# Altium schematic sheet charger.SchDoc
size A3
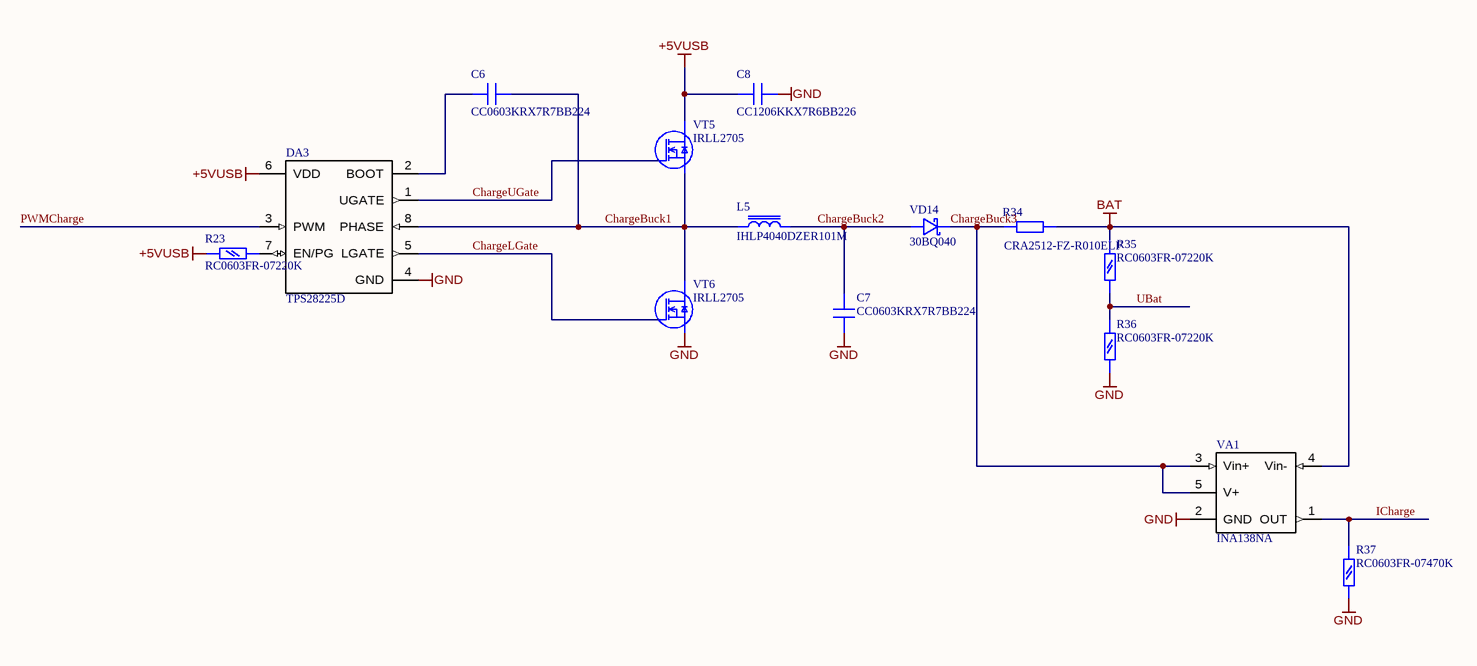
[diagram p0: charger.SchDoc]

## Parts
C6  CC0603KRX7R7BB224  [CapacitorSMD0603(manual)]
C7  CC0603KRX7R7BB224  [CapacitorSMD0603(manual)]
C8  CC1206KKX7R6BB226  [CapacitorSMD1206(reflow)]
DA3  TPS28225D  [SO8]
L5  IHLP4040DZER101M  [IHLP-4040DZ(manual/deep1.5mm)]
R23  RC0603FR-07220K  [ResistorSMD0603(manual)]
R34  CRA2512-FZ-R010ELF  [ResistorSMD2512(reflow)]
R35  RC0603FR-07220K  [ResistorSMD0603(manual)]
R36  RC0603FR-07220K  [ResistorSMD0603(manual)]
R37  RC0603FR-07470K  [ResistorSMD0603(manual)]
VA1  INA138NA  [SOT23-5]
VD14  30BQ040  [SMC]
VT5  IRLL2705  [SOT223]
VT6  IRLL2705  [SOT223]

## Nets
+5VUSB: C8.2 DA3.6(VDD) R23.1 VT5.2(D)
BAT: R34.1 R35.2 VA1.4(Vin-)
GND: C7.1 C8.1 DA3.4(GND) R36.1 R37.1 VA1.2(GND) VT6.3(S)
ChargeBuck1: C6.2 DA3.8(PHASE) L5.1 VT5.3(S) VT6.2(D)
ChargeBuck2: C7.2 L5.2 VD14.1
ChargeBuck3: R34.2 VA1.3(Vin+) VA1.5(V+) VD14.2
ChargeLGate: DA3.5(LGATE) VT6.1(G)
ChargeUGate: DA3.1(UGATE) VT5.1(G)
ICharge: R37.2 VA1.1(OUT)
PWMCharge: DA3.3(PWM)
UBat: R35.1 R36.2
NetC6_1: C6.1 DA3.2(BOOT)
NetDA3_7: DA3.7(EN/PG) R23.2

## Library data of the parts
C6 C7 = CapacitorSMD0603(reflow): CAPACITOR Capacitor SMD 0603 1.6x0.8mm; Описание: Конденсатор SMD 0603; NumberSolderPointsSMD: 0; Аналог: нет; NumberSolderPointsTHT: 0
C8 = CapacitorSMD1206(reflow): CAPACITOR Capacitor SMD 1206 3.2x1.6mm; Описание: Конденсатор SMD 1206; NumberSolderPointsSMD: 0; Аналог: нет; NumberSolderPointsTHT: 0
DA3 = TPS28225D: IC Synchronous MOSFET drivers; Описание: Микросхема SO8; NumberSolderPointsTHT: 0; NumberSolderPointsSMD: 8; x: *; Комплект: *; Аналог: *
L5 = IHLP-4040DZ: MAGNETIC Inductor SMD 4040 h=4mm; Описание: Индуктивность SMD 2525; NumberSolderPointsSMD: 0; Аналог: нет; NumberSolderPointsTHT: 0
R23 R35-R37 = ResistorSMD0603(reflow): RESISTOR Resistor SMD 0603 1.6x0.8mm; Описание: Резистор SMD 0603; NumberSolderPointsSMD: 0; Аналог: нет; NumberSolderPointsTHT: 0
R34 = ResistorSMD2512(reflow): RESISTOR Resistor SMD 2512 6.35x3.2mm; Описание: Резистор SMD 2512; NumberSolderPointsSMD: 0; Аналог: нет; NumberSolderPointsTHT: 0
VA1 = INA138NA: IC High-Side Current Shunt Monitor 2.7...36V; Описание: Микросхема SOT23-5; NumberSolderPointsSMD: 0; Аналог: нет; x: INA138; NumberSolderPointsTHT: 0
VD14 = 30BQ___: DIODE Schottky rectifier; Описание: Диод SMC; NumberSolderPointsSMD: 0; Аналог: нет; x: 30bq040 30bq060 30bq100; NumberSolderPointsTHT: 0
VT5 VT6 = MOSFET_N_SOT223: TRANSISTOR MOSFET N generic sot23; Описание: Транзистор SOT223; NumberSolderPointsSMD: 0; Аналог: нет; x: IRLL2705(55v,3.8A,0.04ohm); NumberSolderPointsTHT: 0